# EAGLE design IDEAdapterDouble (EAGLE 6.6.0)
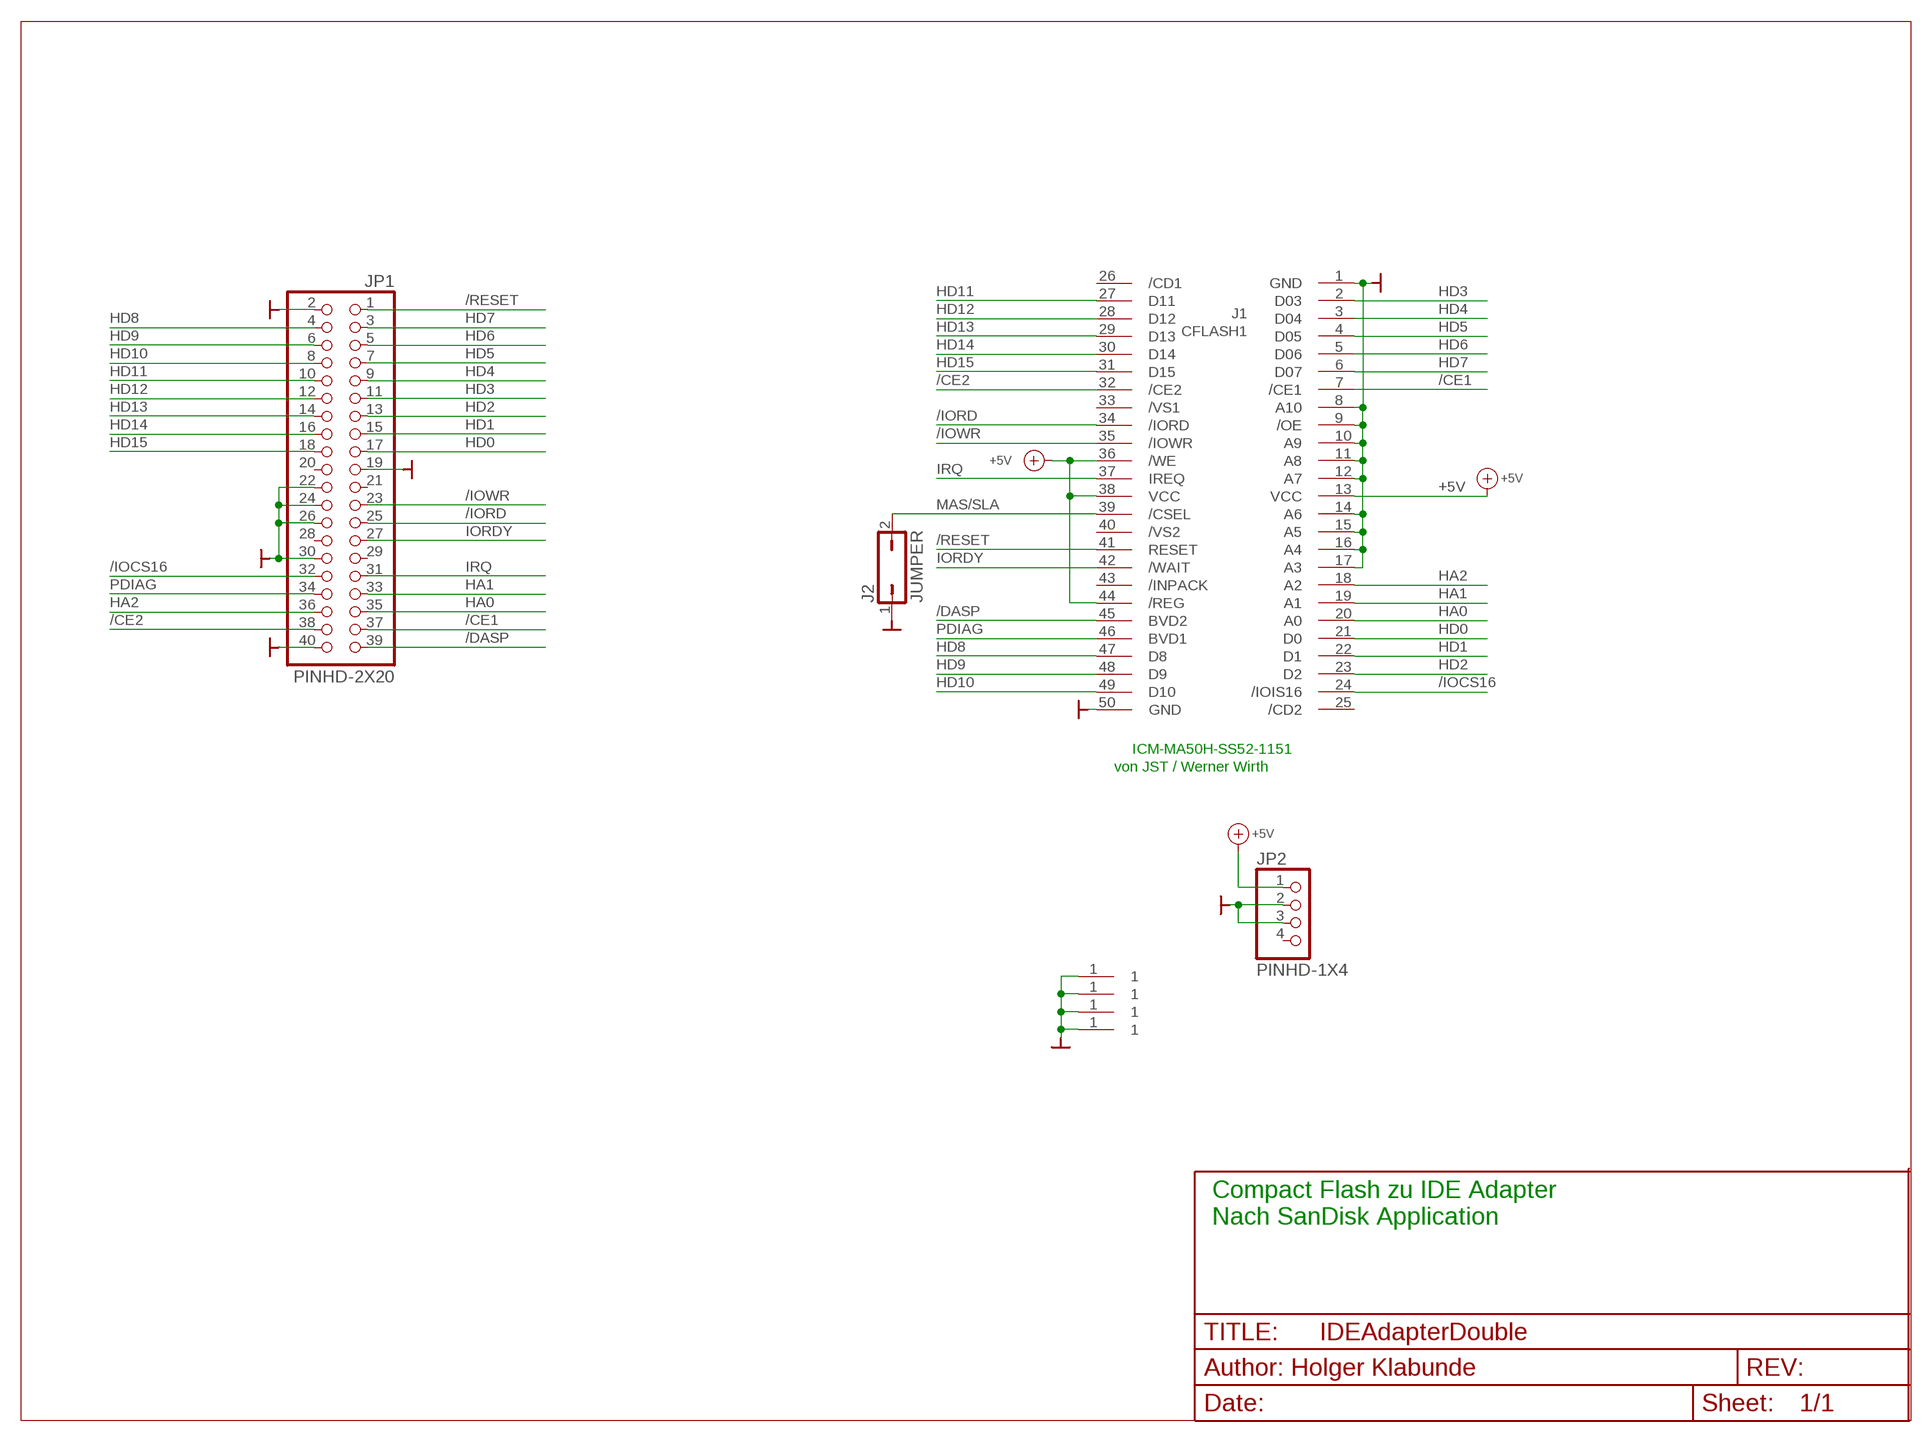
[diagram p0: schematic, sheet 1]

## Parts
J1  CFLASH1  [CFSMT]
J2  JUMPER  JP1Q  [JP1]
JP1  PINHD-2X20  [2X20]
JP2  PINHD-1X4  [1X04]
U$13  BOHRUNG  [BOHRUNG]
U$14  BOHRUNG  [BOHRUNG]
U$16  BOHRUNG  [BOHRUNG]
U$17  BOHRUNG  [BOHRUNG]

## Nets
+5V: J1.13(VCC) J1.36(/WE) J1.38(VCC) J1.44(/REG) JP2.1
/CE1: J1.7(/CE1) JP1.37
/CE2: J1.32(/CE2) JP1.38
/DASP: J1.45(BVD2) JP1.39
/IOCS16: J1.24(/IOIS16) JP1.32
/IORD: J1.34(/IORD) JP1.25
/IOWR: J1.35(/IOWR) JP1.23
/RESET: J1.41(RESET) JP1.1
GND: J1.1(GND) J1.8(A10) J1.9(/OE) J1.10(A9) J1.11(A8) J1.12(A7) J1.14(A6) J1.15(A5) J1.16(A4) J1.17(A3) J1.50(GND) J2.1 JP1.2 JP1.19 JP1.22 JP1.24 JP1.26 JP1.30 JP1.40 JP2.2 JP2.3 U$13.1 U$14.1 U$16.1 U$17.1
HA0: J1.20(A0) JP1.35
HA1: J1.19(A1) JP1.33
HA2: J1.18(A2) JP1.36
HD0: J1.21(D0) JP1.17
HD1: J1.22(D1) JP1.15
HD2: J1.23(D2) JP1.13
HD3: J1.2(D03) JP1.11
HD4: J1.3(D04) JP1.9
HD5: J1.4(D05) JP1.7
HD6: J1.5(D06) JP1.5
HD7: J1.6(D07) JP1.3
HD8: J1.47(D8) JP1.4
HD9: J1.48(D9) JP1.6
HD10: J1.49(D10) JP1.8
HD11: J1.27(D11) JP1.10
HD12: J1.28(D12) JP1.12
HD13: J1.29(D13) JP1.14
HD14: J1.30(D14) JP1.16
HD15: J1.31(D15) JP1.18
IORDY: J1.42(/WAIT) JP1.27
IRQ: J1.37(IREQ) JP1.31
MAS/SLA: J1.39(/CSEL) J2.2
PDIAG: J1.46(BVD1) JP1.34
Unconnected: J1.25(/CD2) J1.26(/CD1) J1.33(/VS1) J1.40(/VS2) J1.43(/INPACK) JP1.20 JP1.21 JP1.28 JP1.29 JP2.4

## Notes on the sheet
- ICM-MA50H-SS52-1151
- von JST / Werner Wirth
- Compact Flash zu IDE Adapter
- Nach SanDisk Application

## Library data of the parts
J1 = IDEAdapterDouble:CFLASH1
J2 = jumper:JP1Q: JUMPER
JP1 = pinhead:PINHD-2X20: PIN HEADER
JP2 = pinhead:PINHD-1X4: PIN HEADER
U$13 U$14 U$16 U$17 = holgnorm:BOHRUNG

## Board
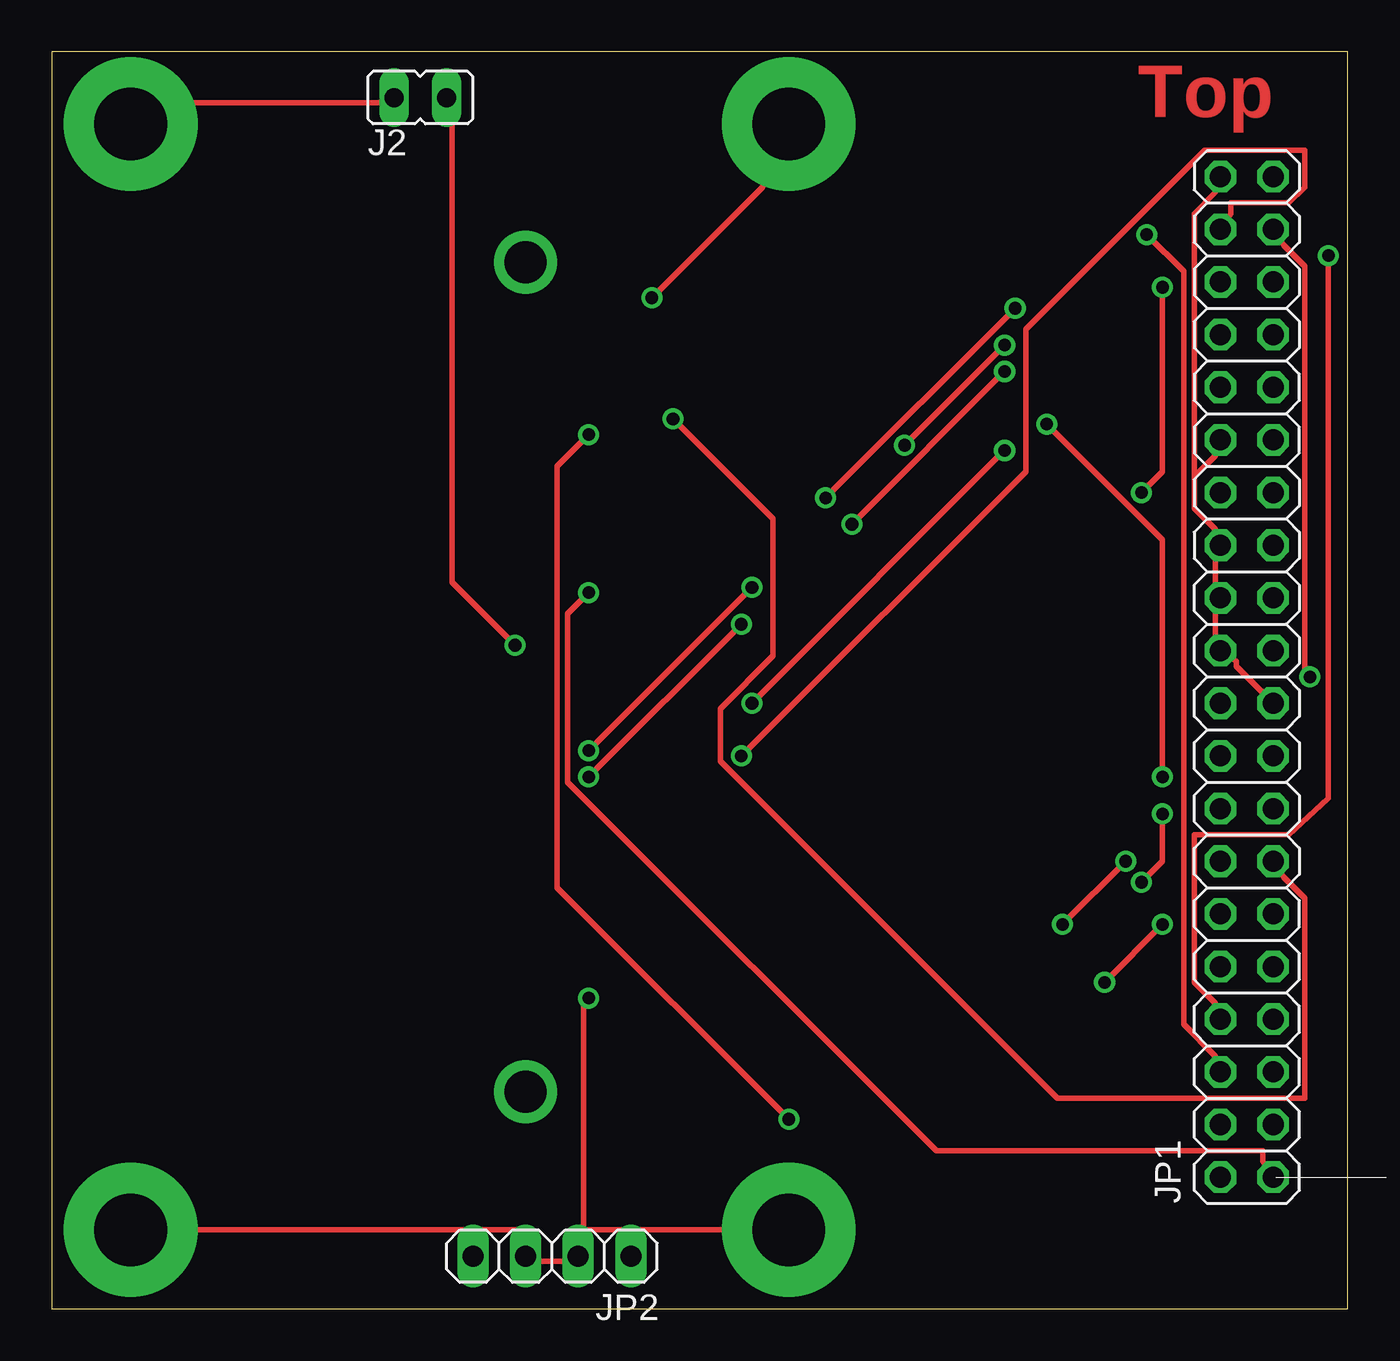
[diagram p1: board, top side]
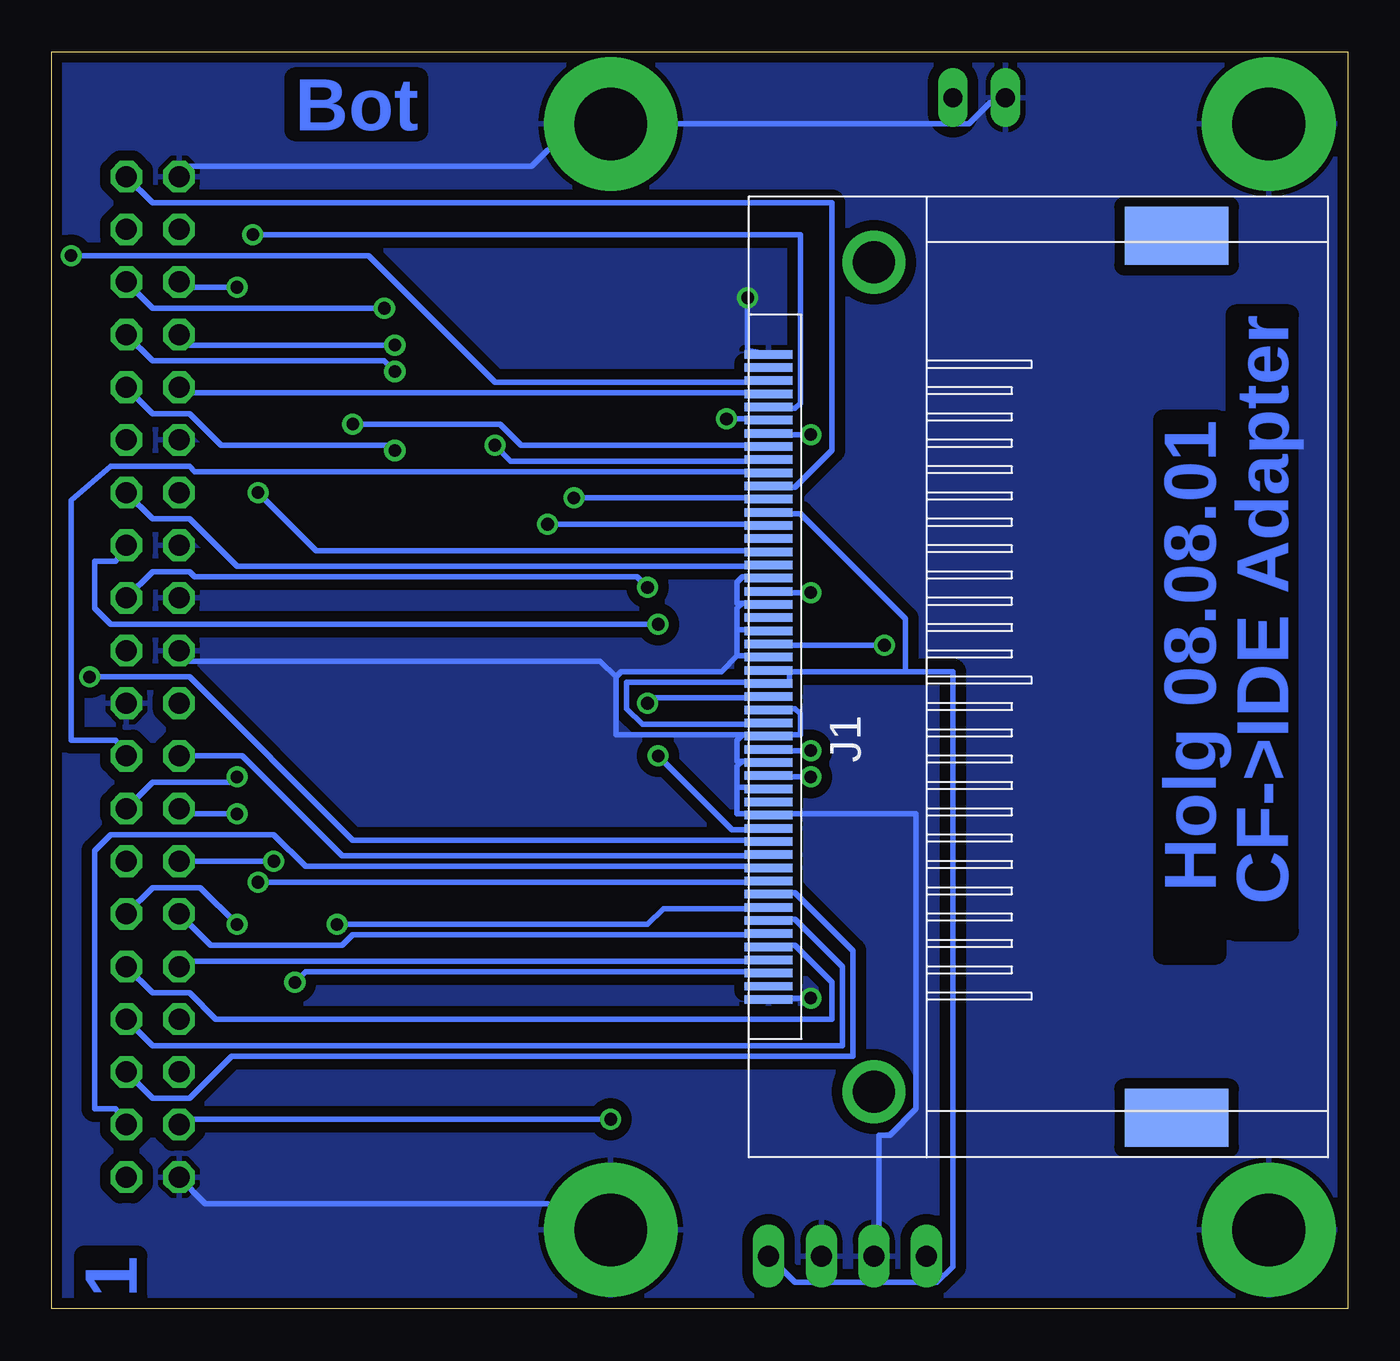
[diagram p2: board, bottom side, seen from below]

Size 62.53 x 60.63 mm. Coordinates in mm from the lower left corner, seen from the top.
Outline: 0,0 62.53,0 62.53,60.63 0,60.63 0,0
Copper layers (1*16): Top 0.035mm / dielectric 1.5mm / Bottom 0.035mm
Design rules "8mils *": minimum track width 10mil, minimum drill 24mil, track to track 8mil, track to pad 8mil, pad to pad 8mil, via to via 8mil, smd to smd 8mil, copper to edge 10mil, drill to drill 10mil, minimum pad ring 10mil, minimum via ring 8mil, stop-mask expansion 0mil, vias tented up to drill 0mil, thermal gap 10mil

### Footprints (pad centres in the part's own frame; a part is rotated, then mirrored left to right if it is on the bottom)
CFSMT = smd 0.406 x 2.311: 1 -15.557,0; 2 -14.287,0; 3 -13.018,0; 4 -11.748,0; 5 -10.477,0; 6 -9.207,0; 7 -7.938,0; 8 -6.668,0; 9 -5.397,0; 10 -4.128,0; 11 -2.857,0; 12 -1.587,0; 13 -0.318,0; 14 0.953,0; 15 2.223,0; 16 3.493,0; 17 4.763,0; 18 6.032,0; 19 7.303,0; 20 8.572,0; 21 9.842,0; 22 11.113,0; 23 12.383,0; 24 13.652,0; 25 14.922,0; 26 -14.922,0; 27 -13.652,0; 28 -12.383,0; 29 -11.113,0; 30 -9.842,0; 31 -8.572,0; 32 -7.303,0; 33 -6.032,0; 34 -4.763,0; 35 -3.493,0; 36 -2.223,0; 37 -0.953,0; 38 0.318,0; 39 1.587,0; 40 2.857,0; 41 4.128,0; 42 5.397,0; 43 6.668,0; 44 7.938,0; 45 9.207,0; 46 10.477,0; 47 11.748,0; 48 13.018,0; 49 14.287,0; 50 15.557,0 | drill 2.032 pad 3.048: GND@1 -20.003,-5.08; GND@2 20.003,-5.08 | smd 2.794 x 5.004: GND@3 -21.273,-19.685; GND@4 21.273,-19.685
JP1 = drill 0.914 long: 1 0,-1.27; 2 0,1.27
2X20 = drill 1.016 octagon: 1 -24.13,-1.27; 2 -24.13,1.27; 3 -21.59,-1.27; 4 -21.59,1.27; 5 -19.05,-1.27; 6 -19.05,1.27; 7 -16.51,-1.27; 8 -16.51,1.27; 9 -13.97,-1.27; 10 -13.97,1.27; 11 -11.43,-1.27; 12 -11.43,1.27; 13 -8.89,-1.27; 14 -8.89,1.27; 15 -6.35,-1.27; 16 -6.35,1.27; 17 -3.81,-1.27; 18 -3.81,1.27; 19 -1.27,-1.27; 20 -1.27,1.27; 21 1.27,-1.27; 22 1.27,1.27; 23 3.81,-1.27; 24 3.81,1.27; 25 6.35,-1.27; 26 6.35,1.27; 27 8.89,-1.27; 28 8.89,1.27; 29 11.43,-1.27; 30 11.43,1.27; 31 13.97,-1.27; 32 13.97,1.27; 33 16.51,-1.27; 34 16.51,1.27; 35 19.05,-1.27; 36 19.05,1.27; 37 21.59,-1.27; 38 21.59,1.27; 39 24.13,-1.27; 40 24.13,1.27
1X04 = drill 1.016 long: 1 -3.81,0; 2 -1.27,0; 3 1.27,0; 4 3.81,0
BOHRUNG = drill 3.505 pad 6.452: 1 0,0

### Placement (x,y rotation side)
J1  27.94,30.48 90 bottom
J2  17.78,58.42 270 top
JP1  57.66,30.48 90 top
JP2  24.13,2.54 180 top
U$13  3.81,3.81 0 top
U$14  3.81,57.15 0 top
U$16  35.56,57.15 0 top
U$17  35.56,3.81 0 top

### Tracks (layer width: path | path; a pad name or v marks a point on that pad's centre or on a via)
+5V
  Bottom 0.254: J1.36 28.96,28.19 34.04,28.19 34.8,28.96 34.8,30.23 28.96,30.23 J1.13 26.92,30.23 26.92,30.73 | 21.34,30.73 21.34,33.27 26.42,38.35 26.92,38.35 J1.44 | 21.34,30.73 26.92,30.73 | 26.92,30.73 J1.38 | 21.34,30.73 19.05,30.73 19.05,2.03 19.81,1.27 26.67,1.27 JP2.1
/CE1  (via drill 0.61)
  Top 0.254: v60.71,30.48 60.45,30.73 60.45,50.29 59.44,51.31 JP1.37
  Bottom 0.254: v60.71,30.48 55.88,30.48 48.01,22.61 28.96,22.61 J1.7
/CE2  (via drill 0.61)
  Top 0.254: v33.27,26.67 46.99,40.39 46.99,47.24 55.63,55.88 60.45,55.88 60.45,54.1 59.69,53.34 56.9,53.34 56.9,52.83 JP1.38
  Bottom 0.254: v33.27,26.67 29.72,23.11 28.96,23.11 J1.32
/DASP
  Bottom 0.254: JP1.39 57.66,53.34 24.89,53.34 24.89,41.4 26.67,39.62 26.92,39.62 J1.45
/IOCS16
  Bottom 0.254: J1.24 28.96,44.2 55.88,44.2 JP1.32
/IORD  (via drill 0.61)
  Top 0.254: v25.91,25.65 v33.27,33.02
  Bottom 0.254: v25.91,25.65 26.92,25.65 J1.34 | v33.27,33.02 59.69,33.02 60.45,33.78 60.45,36.07 59.44,36.07 JP1.25
/IOWR  (via drill 0.61)
  Top 0.254: v25.91,26.92 v33.78,34.8
  Bottom 0.254: v25.91,26.92 26.92,26.92 J1.35 | v33.78,34.8 34.29,35.31 55.63,35.31 55.88,35.56 57.66,35.56 JP1.23
/RESET  (via drill 0.61)
  Top 0.254: v25.91,34.54 24.89,33.53 24.89,25.4 42.67,7.62 58.42,7.62 58.42,7.11 JP1.1
  Bottom 0.254: v25.91,34.54 26.92,34.54 J1.41
GND  (via drill 0.61)
  Top 0.254: v25.91,14.99 25.65,14.73 25.65,3.81 | 25.65,3.81 25.65,3.3 JP2.2 24.64,2.29 23.62,2.29 JP2.3 22.61,3.3 22.61,3.81 U$13.1 | 25.65,3.81 U$17.1 | J2.1 15.75,58.17 6.86,58.17 U$14.1 | v28.96,48.77 34.29,54.1 U$16.1 | 55.12,40.13 56.13,41.15 JP1.30 | 55.12,40.13 55.12,38.61 56.13,37.59 JP1.26 56.13,36.07 56.13,35.05 JP1.24 56.13,33.53 56.13,32.51 JP1.22 57.15,31.24 57.15,30.99 JP1.19 | 55.12,40.13 55.12,52.83 56.13,53.85 JP1.40
  Bottom 0.254: v25.91,14.99 26.92,14.99 J1.1 | JP1.2 55.12,5.08 38.61,5.08 U$17.1 | v28.96,48.77 28.96,46.23 J1.50 | 29.46,31.5 28.96,31.5 J1.14 | 29.46,31.5 29.46,32.77 | 29.46,32.77 28.96,32.77 J1.15 | 29.21,34.04 28.96,34.04 J1.16 | 29.21,34.04 29.46,33.78 29.46,32.77 | 29.21,34.04 29.46,34.04 29.46,35.05 29.21,35.31 28.96,35.31 J1.17 | 29.46,25.15 29.46,23.88 28.96,23.88 J1.8 26.92,23.88 20.83,23.88 20.83,9.65 22.1,8.38 22.61,8.38 22.61,3.3 JP2.3 | 29.46,25.15 28.96,25.15 J1.9 | 29.21,26.42 28.96,26.42 J1.10 | 29.21,26.42 29.46,26.16 29.46,25.15 | 29.21,27.69 28.96,27.69 J1.11 26.92,27.69 26.42,27.69 26.42,28.7 26.67,28.96 26.92,28.96 J1.12 | 29.21,27.69 29.46,27.43 29.46,26.42 29.21,26.42 | 29.46,31.5 30.23,30.73 35.05,30.73 35.31,30.48 | 35.31,30.48 35.31,27.69 29.21,27.69 | 35.31,30.48 36.07,31.24 55.88,31.24 JP1.22 | JP1.40 55.88,55.12 39.37,55.12 38.61,55.88 U$16.1 18.29,57.15 17.27,58.17 J2.1
  pour Bottom (isolate 0.508): 0.38,60.33 0.38,0.64 62.23,0.64 62.23,60.33
HA0  (via drill 0.61)
  Top 0.254: v37.34,39.12 v46.48,48.26
  Bottom 0.254: v37.34,39.12 28.96,39.12 J1.20 | v46.48,48.26 57.66,48.26 JP1.35
HA1  (via drill 0.61)
  Top 0.254: v38.61,37.85 v45.97,45.21
  Bottom 0.254: v38.61,37.85 28.96,37.85 J1.19 | v45.97,45.21 46.48,45.72 57.66,45.72 JP1.33
HA2  (via drill 0.61)
  Top 0.254: v52.58,39.37 53.59,40.39 v53.59,49.28
  Bottom 0.254: v52.58,39.37 49.78,36.58 28.96,36.58 J1.18 | v53.59,49.28 55.88,49.28 JP1.36
HD0
  Bottom 0.254: J1.21 28.96,40.39 55.63,40.39 55.88,40.64 59.69,40.64 61.59,38.99 61.59,27.43 59.44,27.43 JP1.17
HD1  (via drill 0.61)
  Top 0.254: v48.01,42.67 53.59,37.08 v53.59,25.65
  Bottom 0.254: v48.01,42.67 40.89,42.67 39.88,41.66 28.96,41.66 J1.22 | v53.59,25.65 53.85,25.4 57.66,25.4 JP1.15
HD2  (via drill 0.61)
  Top 0.254: v29.97,42.93 34.8,38.1 34.8,31.5 32.26,28.96 32.26,26.42 48.51,10.16 60.45,10.16 60.45,19.81 59.44,20.83 JP1.13
  Bottom 0.254: v29.97,42.93 28.96,42.93 J1.23
HD3  (via drill 0.61)
  Top 0.254: v50.8,15.75 v53.59,18.54
  Bottom 0.254: v50.8,15.75 50.29,16.26 28.96,16.26 J1.2 | v53.59,18.54 55.37,20.32 57.66,20.32 JP1.11
HD4
  Bottom 0.254: JP1.9 57.66,15.24 55.88,15.24 54.61,13.97 24.89,13.97 24.89,15.75 26.67,17.53 26.92,17.53 J1.3
HD5
  Bottom 0.254: JP1.7 57.66,12.7 24.38,12.7 24.38,16.51 26.67,18.8 26.92,18.8 J1.4
HD6
  Bottom 0.254: JP1.5 57.66,10.16 55.88,10.16 53.85,12.19 23.88,12.19 23.88,17.27 26.67,20.07 26.92,20.07 J1.5
HD7
  Bottom 0.254: J1.6 28.96,21.34 50.29,21.34 51.82,22.86 59.69,22.86 60.45,22.1 60.45,9.65 59.44,9.65 JP1.3
HD8  (via drill 0.61)
  Top 0.254: v25.91,42.16 24.38,40.64 24.38,20.32 v35.56,9.14
  Bottom 0.254: v25.91,42.16 26.92,42.16 J1.47 | v35.56,9.14 55.88,9.14 JP1.4
HD9  (via drill 0.61)
  Top 0.254: v52.83,51.82 54.61,50.04 54.61,13.72 56.13,12.19 JP1.6
  Bottom 0.254: v52.83,51.82 26.42,51.82 26.42,43.69 26.67,43.43 26.92,43.43 J1.48
HD10  (via drill 0.61)
  Top 0.254: v61.59,50.8 61.59,24.64 59.69,22.86 55.12,22.86 55.12,15.75 56.13,14.73 JP1.8
  Bottom 0.254: v61.59,50.8 47.24,50.8 41.15,44.7 28.96,44.7 J1.49
HD11
  Bottom 0.254: J1.27 28.96,16.76 55.88,16.76 JP1.10
HD12
  Bottom 0.254: JP1.12 54.86,17.53 48.51,17.53 48.01,18.03 28.96,18.03 J1.28
HD13  (via drill 0.61)
  Top 0.254: v48.77,18.54 v51.82,21.59
  Bottom 0.254: v48.77,18.54 33.78,18.54 33.02,19.3 28.96,19.3 J1.29 | v51.82,21.59 JP1.14
HD14  (via drill 0.61)
  Top 0.254: v52.58,20.57 53.59,21.59 v53.59,23.88
  Bottom 0.254: v52.58,20.57 28.96,20.57 J1.30 | v53.59,23.88 55.88,23.88 JP1.16
HD15
  Bottom 0.254: J1.31 28.96,21.84 48.51,21.84 53.34,26.67 JP1.18
IORDY
  Bottom 0.254: JP1.27 57.66,38.1 55.88,38.1 53.59,35.81 28.96,35.81 J1.42
IRQ  (via drill 0.61)
  Top 0.254: v33.78,29.21 v45.97,41.4
  Bottom 0.254: v33.78,29.21 33.53,29.46 28.96,29.46 J1.37 | v45.97,41.4 46.23,41.66 54.36,41.66 55.88,43.18 57.66,43.18 JP1.31
MAS/SLA  (via drill 0.61)
  Top 0.254: v22.35,32 19.3,35.05 19.3,57.66 J2.2
  Bottom 0.254: v22.35,32 26.92,32 J1.39
PDIAG  (via drill 0.61)
  Top 0.254: v41.15,41.66 v45.97,46.48
  Bottom 0.254: v41.15,41.66 40.39,40.89 28.96,40.89 J1.46 | v45.97,46.48 55.88,46.48 JP1.34

### Text on the board
Top: Top
Bottom: Bot | CF->IDE Adapter | Holg 08.08.01 | 1